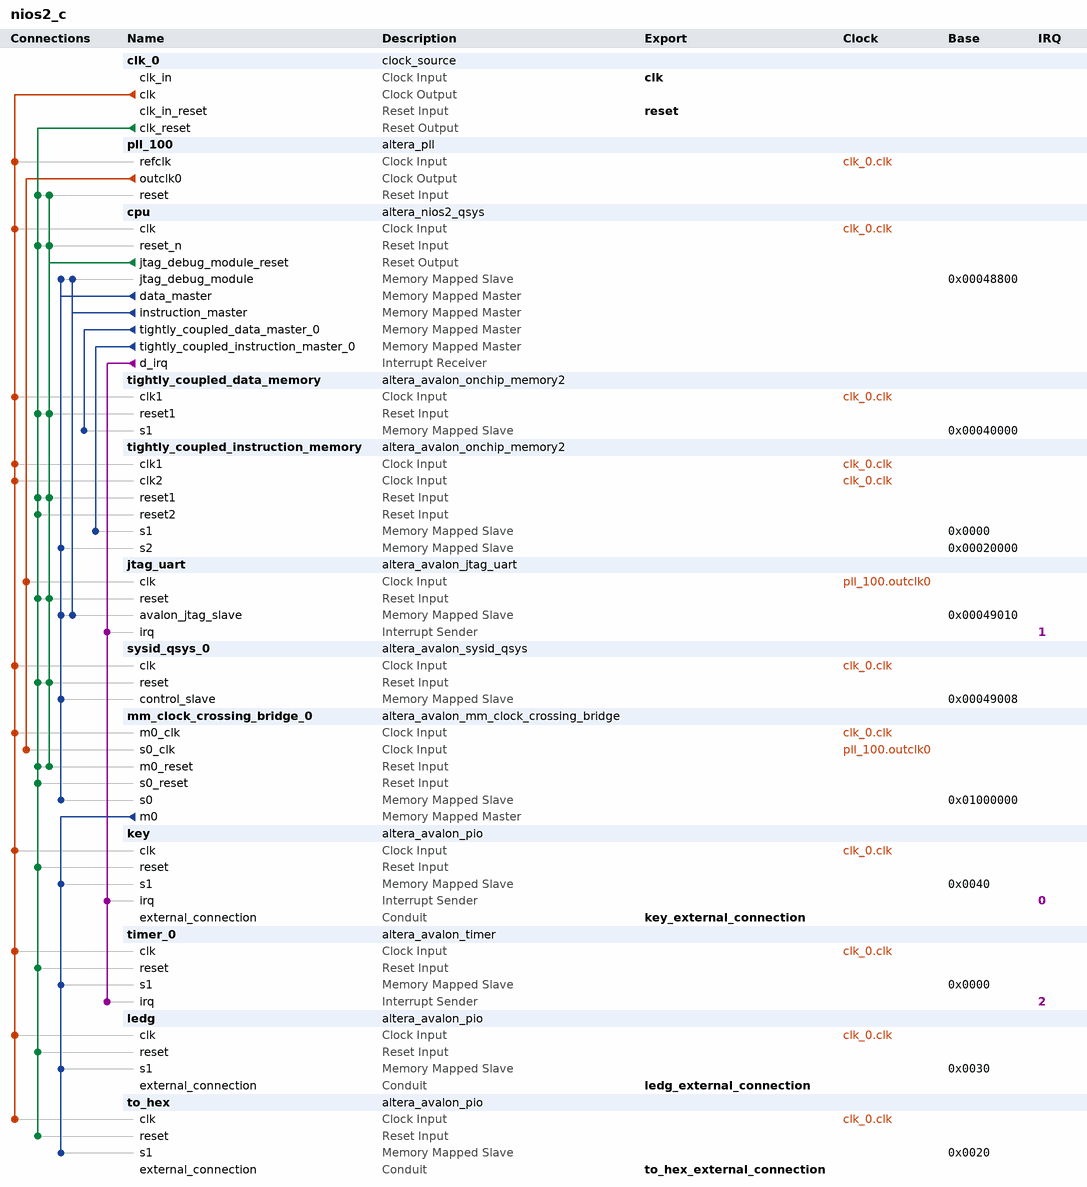
[diagram p0: system contents]
# Platform Designer (Qsys) system nios2_c, Cyclone V 5CGXFC5C6F27C6
# Parameters at their usual value, and those the tool derives, are not listed.
package require -exact qsys 13.1
create_system nios2_c
set_project_property DEVICE_FAMILY {Cyclone V}
set_project_property DEVICE 5CGXFC5C6F27C6

add_instance clk_0 clock_source 13.1
set_instance_parameter_value clk_0 clockFrequency 50000000

add_instance pll_100 altera_pll 13.1
set_instance_parameter_value pll_100 gui_device_speed_grade 2
set_instance_parameter_value pll_100 gui_pll_mode {Integer-N PLL}
set_instance_parameter_value pll_100 gui_reference_clock_frequency 50.0
set_instance_parameter_value pll_100 gui_operation_mode normal
set_instance_parameter_value pll_100 gui_use_locked false
set_instance_parameter_value pll_100 gui_number_of_clocks 1
set_instance_parameter_value pll_100 gui_output_clock_frequency0 100.0

add_instance cpu altera_nios2_qsys 13.1
set_instance_parameter_value cpu muldiv_divider true
set_instance_parameter_value cpu resetSlave tightly_coupled_instruction_memory.s1
set_instance_parameter_value cpu mmu_TLBMissExcSlave cpu.jtag_debug_module
set_instance_parameter_value cpu exceptionSlave tightly_coupled_instruction_memory.s1
set_instance_parameter_value cpu breakSlave cpu.jtag_debug_module
set_instance_parameter_value cpu muldiv_multiplierType NoneSmall
set_instance_parameter_value cpu impl Fast
set_instance_parameter_value cpu icache_size 16384
set_instance_parameter_value cpu icache_numTCIM 1
set_instance_parameter_value cpu icache_burstType Sequential
set_instance_parameter_value cpu dcache_bursts true
set_instance_parameter_value cpu dcache_size 16384
set_instance_parameter_value cpu dcache_numTCDM 1

add_instance tightly_coupled_data_memory altera_avalon_onchip_memory2 13.1
set_instance_parameter_value tightly_coupled_data_memory dataWidth 32
set_instance_parameter_value tightly_coupled_data_memory dualPort false
set_instance_parameter_value tightly_coupled_data_memory initMemContent true
set_instance_parameter_value tightly_coupled_data_memory initializationFileName onchip_mem.hex
set_instance_parameter_value tightly_coupled_data_memory memorySize 20000

add_instance tightly_coupled_instruction_memory altera_avalon_onchip_memory2 13.1
set_instance_parameter_value tightly_coupled_instruction_memory dataWidth 32
set_instance_parameter_value tightly_coupled_instruction_memory dualPort true
set_instance_parameter_value tightly_coupled_instruction_memory initMemContent true
set_instance_parameter_value tightly_coupled_instruction_memory initializationFileName onchip_mem.hex
set_instance_parameter_value tightly_coupled_instruction_memory memorySize 80000

add_instance jtag_uart altera_avalon_jtag_uart 13.1
set_instance_parameter_value jtag_uart simInteractiveOptions NO_INTERACTIVE_WINDOWS

add_instance sysid_qsys_0 altera_avalon_sysid_qsys 13.1
set_instance_parameter_value sysid_qsys_0 id 74565

add_instance mm_clock_crossing_bridge_0 altera_avalon_mm_clock_crossing_bridge 13.1
set_instance_parameter_value mm_clock_crossing_bridge_0 DATA_WIDTH 32
set_instance_parameter_value mm_clock_crossing_bridge_0 ADDRESS_WIDTH 10
set_instance_parameter_value mm_clock_crossing_bridge_0 MAX_BURST_SIZE 1
set_instance_parameter_value mm_clock_crossing_bridge_0 COMMAND_FIFO_DEPTH 4
set_instance_parameter_value mm_clock_crossing_bridge_0 RESPONSE_FIFO_DEPTH 4
set_instance_parameter_value mm_clock_crossing_bridge_0 MASTER_SYNC_DEPTH 2
set_instance_parameter_value mm_clock_crossing_bridge_0 SLAVE_SYNC_DEPTH 2

add_instance key altera_avalon_pio 13.1
set_instance_parameter_value key direction Input
set_instance_parameter_value key generateIRQ true
set_instance_parameter_value key width 4

add_instance timer_0 altera_avalon_timer 13.1
set_instance_parameter_value timer_0 period 1
set_instance_parameter_value timer_0 periodUnits MSEC

add_instance ledg altera_avalon_pio 13.1
set_instance_parameter_value ledg direction Output
set_instance_parameter_value ledg width 8

add_instance to_hex altera_avalon_pio 13.1
set_instance_parameter_value to_hex direction Output
set_instance_parameter_value to_hex width 14

# connections
add_connection clk_0.clk cpu.clk clock
add_connection clk_0.clk key.clk clock
add_connection clk_0.clk ledg.clk clock
add_connection clk_0.clk mm_clock_crossing_bridge_0.m0_clk clock
add_connection clk_0.clk pll_100.refclk clock
add_connection clk_0.clk sysid_qsys_0.clk clock
add_connection clk_0.clk tightly_coupled_data_memory.clk1 clock
add_connection clk_0.clk tightly_coupled_instruction_memory.clk1 clock
add_connection clk_0.clk tightly_coupled_instruction_memory.clk2 clock
add_connection clk_0.clk timer_0.clk clock
add_connection clk_0.clk to_hex.clk clock
add_connection pll_100.outclk0 jtag_uart.clk clock
add_connection pll_100.outclk0 mm_clock_crossing_bridge_0.s0_clk clock
add_connection clk_0.clk_reset cpu.reset_n reset
add_connection clk_0.clk_reset jtag_uart.reset reset
add_connection clk_0.clk_reset key.reset reset
add_connection clk_0.clk_reset ledg.reset reset
add_connection clk_0.clk_reset mm_clock_crossing_bridge_0.m0_reset reset
add_connection clk_0.clk_reset mm_clock_crossing_bridge_0.s0_reset reset
add_connection clk_0.clk_reset pll_100.reset reset
add_connection clk_0.clk_reset sysid_qsys_0.reset reset
add_connection clk_0.clk_reset tightly_coupled_data_memory.reset1 reset
add_connection clk_0.clk_reset tightly_coupled_instruction_memory.reset1 reset
add_connection clk_0.clk_reset tightly_coupled_instruction_memory.reset2 reset
add_connection clk_0.clk_reset timer_0.reset reset
add_connection clk_0.clk_reset to_hex.reset reset
add_connection cpu.jtag_debug_module_reset cpu.reset_n reset
add_connection cpu.jtag_debug_module_reset jtag_uart.reset reset
add_connection cpu.jtag_debug_module_reset mm_clock_crossing_bridge_0.m0_reset reset
add_connection cpu.jtag_debug_module_reset pll_100.reset reset
add_connection cpu.jtag_debug_module_reset sysid_qsys_0.reset reset
add_connection cpu.jtag_debug_module_reset tightly_coupled_data_memory.reset1 reset
add_connection cpu.jtag_debug_module_reset tightly_coupled_instruction_memory.reset1 reset
add_connection cpu.data_master cpu.jtag_debug_module avalon
set_connection_parameter_value cpu.data_master/cpu.jtag_debug_module baseAddress 0x00048800
add_connection cpu.data_master jtag_uart.avalon_jtag_slave avalon
set_connection_parameter_value cpu.data_master/jtag_uart.avalon_jtag_slave baseAddress 0x00049010
add_connection cpu.data_master mm_clock_crossing_bridge_0.s0 avalon
set_connection_parameter_value cpu.data_master/mm_clock_crossing_bridge_0.s0 baseAddress 0x01000000
add_connection cpu.data_master sysid_qsys_0.control_slave avalon
set_connection_parameter_value cpu.data_master/sysid_qsys_0.control_slave baseAddress 0x00049008
add_connection cpu.data_master tightly_coupled_instruction_memory.s2 avalon
set_connection_parameter_value cpu.data_master/tightly_coupled_instruction_memory.s2 baseAddress 0x00020000
add_connection cpu.instruction_master cpu.jtag_debug_module avalon
set_connection_parameter_value cpu.instruction_master/cpu.jtag_debug_module baseAddress 0x00048800
add_connection cpu.instruction_master jtag_uart.avalon_jtag_slave avalon
set_connection_parameter_value cpu.instruction_master/jtag_uart.avalon_jtag_slave baseAddress 0x00049010
add_connection cpu.tightly_coupled_data_master_0 tightly_coupled_data_memory.s1 avalon
set_connection_parameter_value cpu.tightly_coupled_data_master_0/tightly_coupled_data_memory.s1 baseAddress 0x00040000
add_connection cpu.tightly_coupled_instruction_master_0 tightly_coupled_instruction_memory.s1 avalon
set_connection_parameter_value cpu.tightly_coupled_instruction_master_0/tightly_coupled_instruction_memory.s1 baseAddress 0x0000
add_connection mm_clock_crossing_bridge_0.m0 key.s1 avalon
set_connection_parameter_value mm_clock_crossing_bridge_0.m0/key.s1 baseAddress 0x0040
add_connection mm_clock_crossing_bridge_0.m0 ledg.s1 avalon
set_connection_parameter_value mm_clock_crossing_bridge_0.m0/ledg.s1 baseAddress 0x0030
add_connection mm_clock_crossing_bridge_0.m0 timer_0.s1 avalon
set_connection_parameter_value mm_clock_crossing_bridge_0.m0/timer_0.s1 baseAddress 0x0000
add_connection mm_clock_crossing_bridge_0.m0 to_hex.s1 avalon
set_connection_parameter_value mm_clock_crossing_bridge_0.m0/to_hex.s1 baseAddress 0x0020
add_connection cpu.d_irq jtag_uart.irq interrupt
set_connection_parameter_value cpu.d_irq/jtag_uart.irq irqNumber 1
add_connection cpu.d_irq key.irq interrupt
set_connection_parameter_value cpu.d_irq/key.irq irqNumber 0
add_connection cpu.d_irq timer_0.irq interrupt
set_connection_parameter_value cpu.d_irq/timer_0.irq irqNumber 2

# exported interfaces
add_interface clk clock sink
set_interface_property clk EXPORT_OF clk_0.clk_in
add_interface reset reset sink
set_interface_property reset EXPORT_OF clk_0.clk_in_reset
add_interface key_external_connection conduit end
set_interface_property key_external_connection EXPORT_OF key.external_connection
add_interface ledg_external_connection conduit end
set_interface_property ledg_external_connection EXPORT_OF ledg.external_connection
add_interface to_hex_external_connection conduit end
set_interface_property to_hex_external_connection EXPORT_OF to_hex.external_connection

set_interconnect_requirement {$system} qsys_mm.clockCrossingAdapter HANDSHAKE
set_interconnect_requirement {$system} qsys_mm.maxAdditionalLatency 1

save_system nios2_c.qsys
